# Altium project SCH-90818_A.PrjPcb (part 3 of 3)

## Sheet 09 MCU_LINK_USB.SchDoc
size 513 x 386 mm
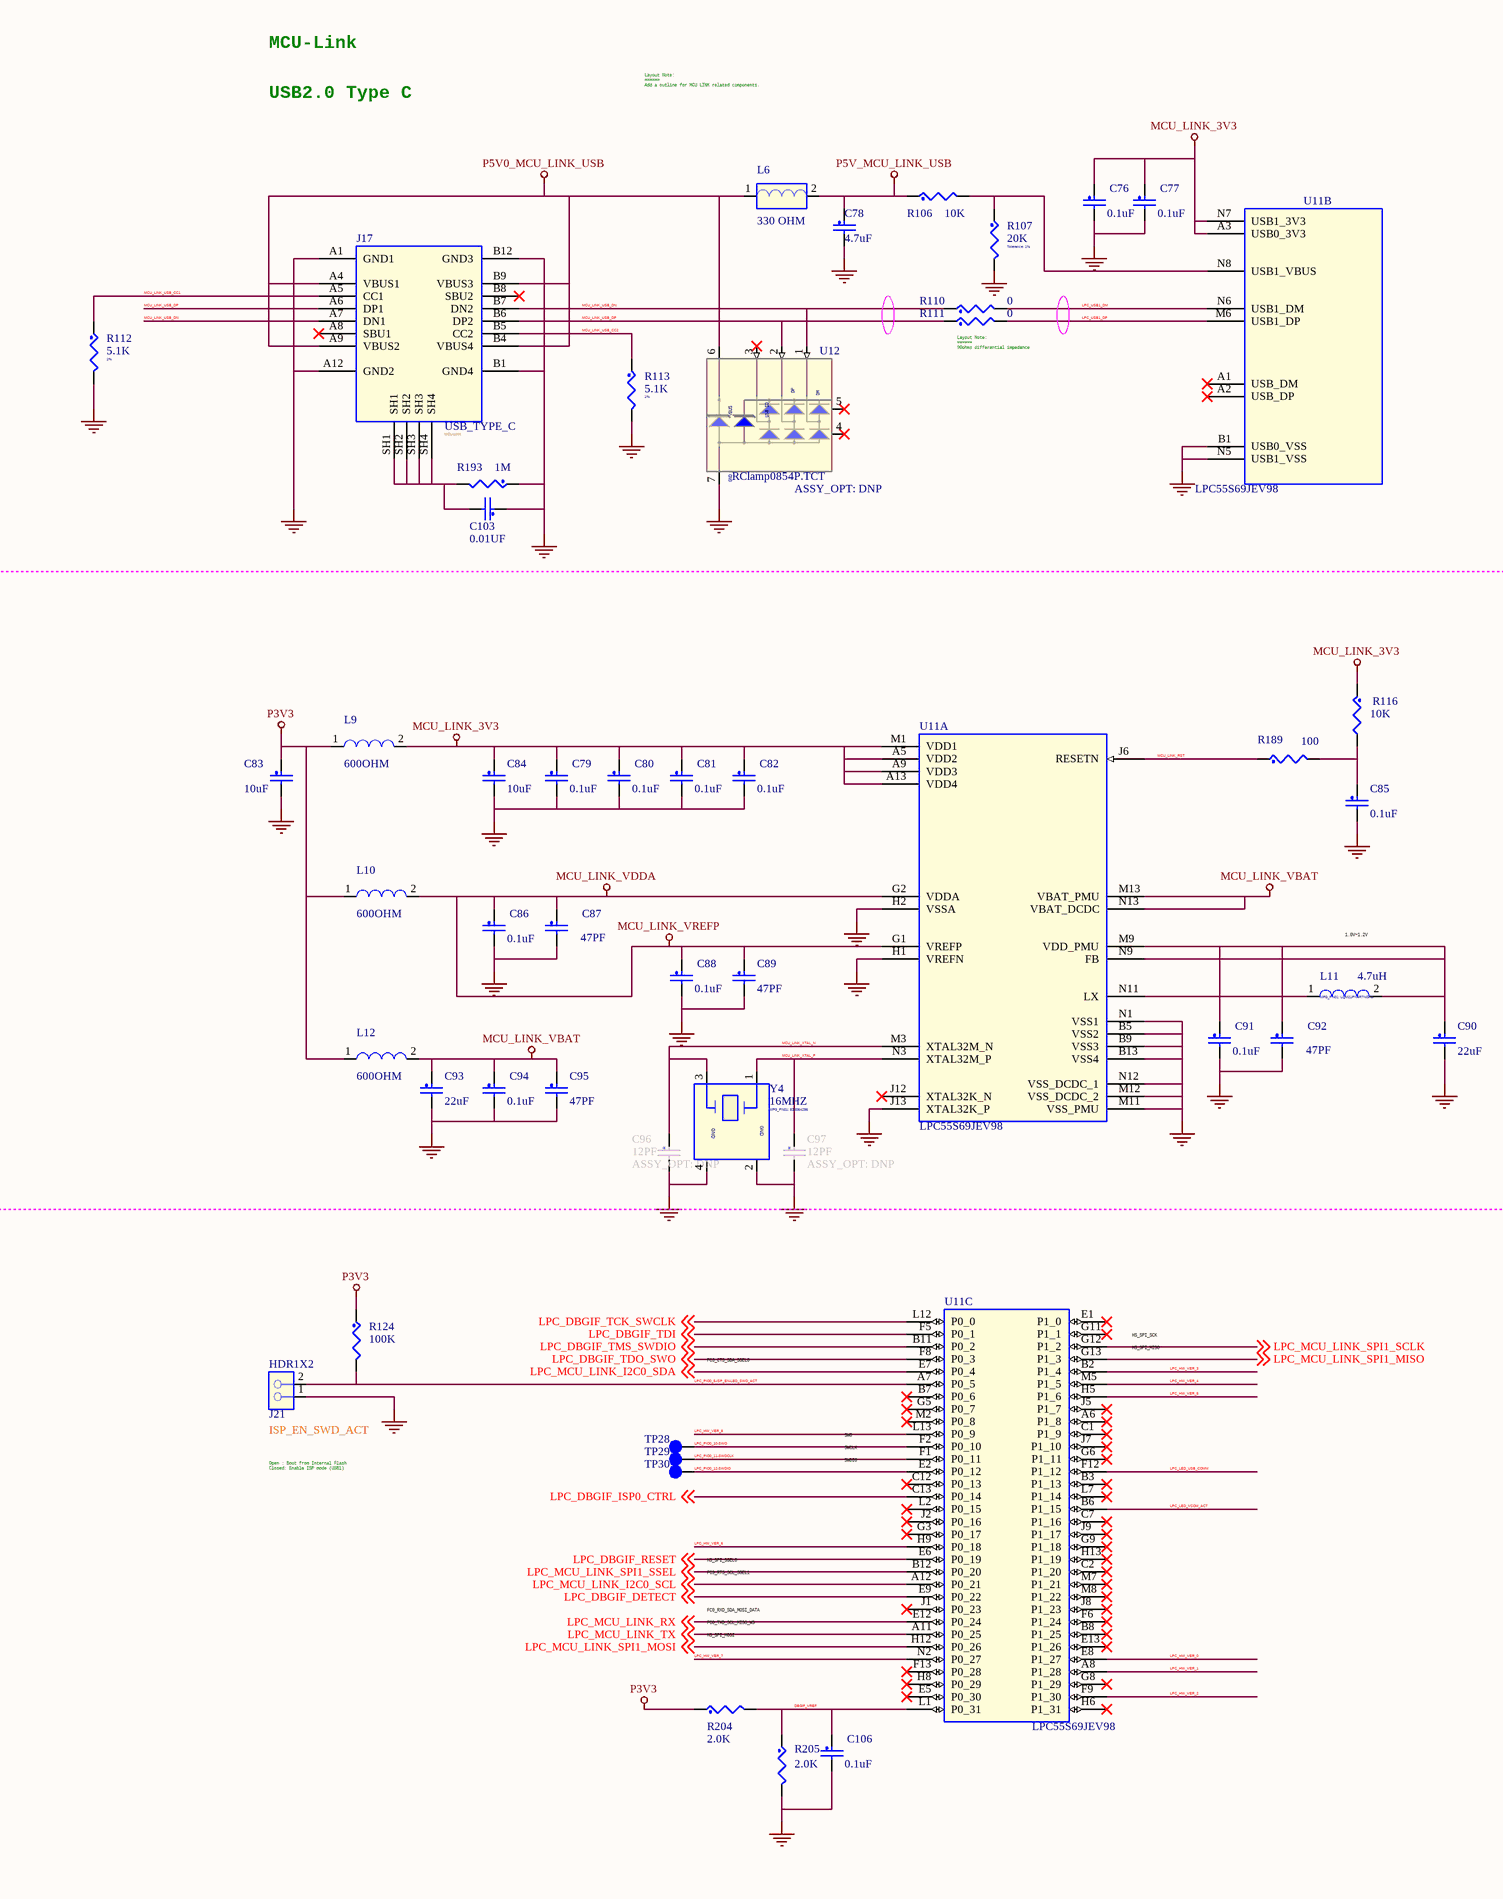
[diagram p10: 09 MCU_LINK_USB.SchDoc, left]
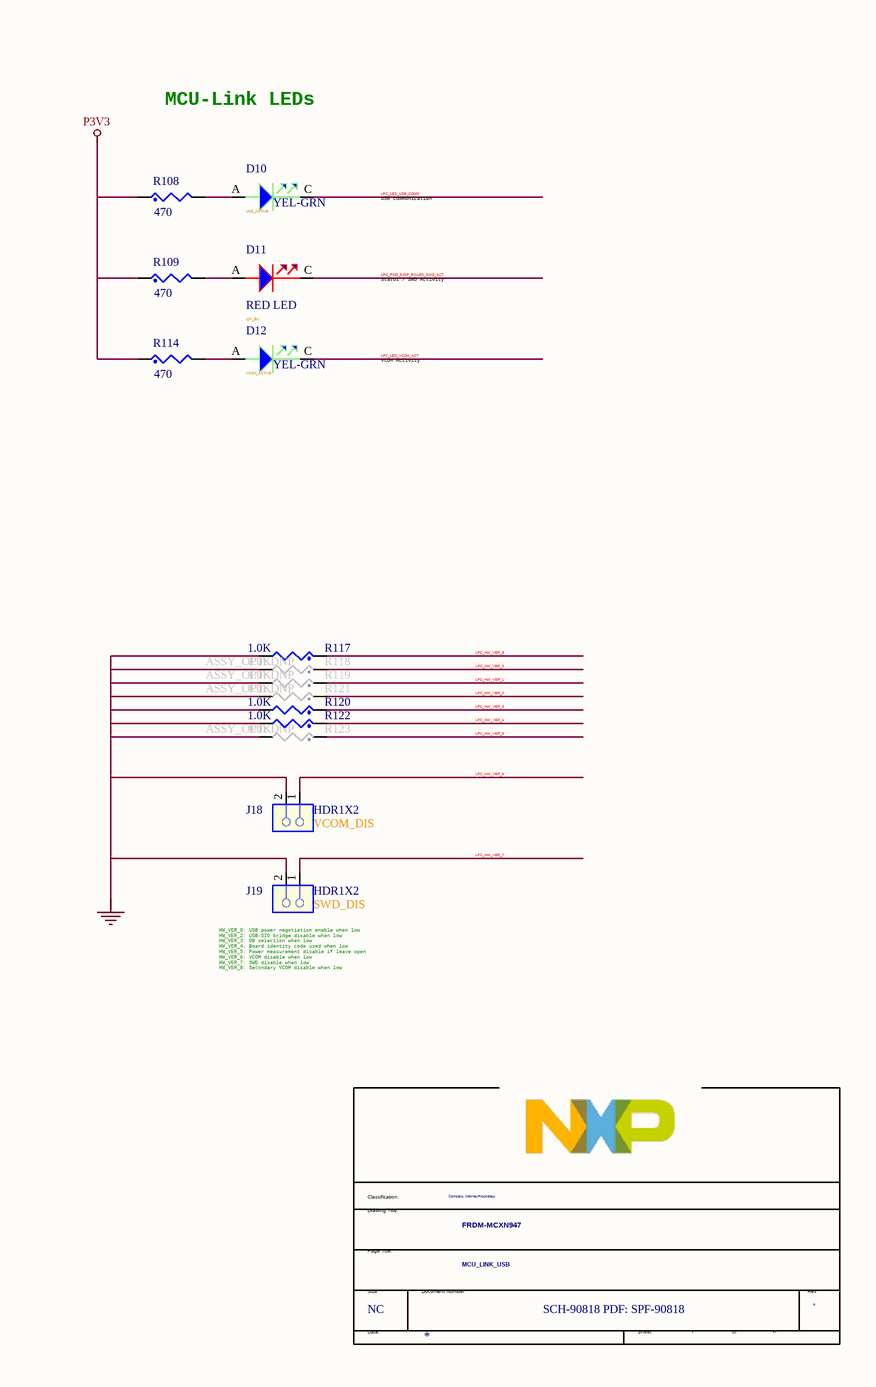
[diagram p11: 09 MCU_LINK_USB.SchDoc, right]

### Parts
(Parts that share a designator on the sheet are numbered #1, #2 ... from top to bottom, then left to right.)
*#6  Doc: SCH-90818 PDF: SPF-90818  RevCode: A  Title: FRDM-MCXN947  Page Size: NC  Page Number: 9  Page Count: 13  PageTitle: MCU_LINK_USB  Classification: Company Internal/Proprietary  (hidden comment: TitleBlock_FS)  (graphical)
C76  0.1uF  [CC0402_25]
C77  0.1uF  [CC0402_25]
C78  4.7uF  [CC0603_OV]
C79  0.1uF  [CC0402_25]
C80  0.1uF  [CC0402_25]
C81  0.1uF  [CC0402_25]
C82  0.1uF  [CC0402_25]
C83  10uF  [CC0603_OV]
C84  10uF  [CC0603_OV]
C85  0.1uF  [CC0402_25]
C86  0.1uF  [CC0402_25]
C87  47PF  [CC0402_25]
C88  0.1uF  [CC0402_25]
C89  47PF  [CC0402_25]
C90  22uF  [CC0603_OV]
C91  0.1uF  [CC0402_25]
C92  47PF  [CC0402_25]
C93  22uF  [CC0603_OV]
C94  0.1uF  [CC0402_25]
C95  47PF  [CC0402_25]
C96  12PF  ASSY_OPT: DNP  [CC0402_25]
C97  12PF  ASSY_OPT: DNP  [CC0402_25]
C103  0.01UF  [CC0805_OV]
C106  0.1uF  [CC0402_25]
D10  YEL-GRN  SILK: USB_ACTIVE  [led_1x0p6_sm]
D11  RED LED  SILK: ISP_EN  [led_1p1_1p1x0p6_sm]
D12  YEL-GRN  SILK: VCOM_ACTIVE  [led_1x0p6_sm]
J17  USB_TYPE_C  SILK: MCU-LINK  [con16_usb_type-c_ra_th]
J18  HDR1X2  SILK: VCOM_DIS  [hdr1x2_5p48x2p69]
J19  HDR1X2  SILK: SWD_DIS  [hdr1x2_5p48x2p69]
J21  HDR1X2  SILK: ISP_EN_SWD_ACT  [hdr1x2_5p48x2p69]
L6  330 OHM  [ind_1608]
L9  600OHM  [ind_1p8x1mm_sm]
L10  600OHM  [ind_1p8x1mm_sm]
L11  4.7uH  MFG_PN01: LQM21PN4R7NGRD  [IND_0805]
L12  600OHM  [ind_1p8x1mm_sm]
R106  10K  [RC0402_25]
R107  20K  Tolerance: 1%  [RC0402_25]
R108  470  [RC0402_25]
R109  470  [RC0402_25]
R110  0  [RC0402_25]
R111  0  [RC0402_25]
R112  5.1K  Tolerance: 1%  [RC0402_25]
R113  5.1K  Tolerance: 1%  [RC0402_25]
R114  470  [RC0402_25]
R116  10K  [RC0402_25]
R117  1.0K  [RC0402_25]
R118  1.0K  ASSY_OPT: DNP  [RC0402_25]
R119  1.0K  ASSY_OPT: DNP  [RC0402_25]
R120  1.0K  [RC0402_25]
R121  1.0K  ASSY_OPT: DNP  [RC0402_25]
R122  1.0K  [RC0402_25]
R123  1.0K  ASSY_OPT: DNP  [RC0402_25]
R124  100K  [RC0402_25]
R189  100  [RC0402_25]
R193  1M  [RC0805_OV]
R204  2.0K  [RC0402_25]
R205  2.0K  [RC0402_25]
TP28  TPAD_030  [TPAD_030]  (value not drawn)
TP29  TPAD_030  [TPAD_030]  (value not drawn)
TP30  TPAD_030  [TPAD_030]  (value not drawn)
U11  LPC55S69JEV98  [bga98_0p5_7x7]  (parts A,B,C of 3)
U12  RClamp0854P.TCT  ASSY_OPT: DNP  [slp1616p6]
Y4  16MHZ  MFG_PN01: 830064296  [xtal4_3p4x2p7_sm]

### Nets
GND: C76.2 C77.2 C78.2 C79.2 C80.2 C81.2 C82.2 C83.2 C84.2 C85.2 C86.2 C87.2 C88.2 C89.2 C90.2 C91.2 C92.2 C93.2 C94.2 C95.2 C96.2 C97.2 C103.1 C106.2 J17.A1(GND1) J17.A12(GND2) J17.B1(GND4) J17.B12(GND3) J18.2 J19.2 J21.1 R107.2 R112.2 R113.2 R117.2 R118.2 R119.2 R120.2 R121.2 R122.2 R123.2 R193.1 R205.2 U11.B1(USB0_VSS) U11.B5(VSS2) U11.B9(VSS3) U11.B13(VSS4) U11.H1(VREFN) U11.H2(VSSA) U11.J13(XTAL32K_P) U11.M11(VSS_PMU) U11.M12(VSS_DCDC_2) U11.N1(VSS1) U11.N5(USB1_VSS) U11.N12(VSS_DCDC_1) U12.7(GND) Y4.2 Y4.4
MCU_LINK_3V3: C76.1 C77.1 C79.1 C80.1 C81.1 C82.1 C84.1 L9.2 R116.1 U11.A3(USB0_3V3) U11.A5(VDD2) U11.A9(VDD3) U11.A13(VDD4) U11.M1(VDD1) U11.N7(USB1_3V3)
MCU_LINK_VBAT: C93.1 C94.1 C95.1 L12.2 U11.M13(VBAT_PMU) U11.N13(VBAT_DCDC)
MCU_LINK_VDDA: C86.1 C87.1 C88.1 C89.1 L10.2 U11.G1(VREFP) U11.G2(VDDA)  [also labelled MCU_LINK_VREFP]
P3V3: C83.1 L9.1 L10.1 L12.1 R108.1 R109.1 R114.1 R124.1 R204.1
P5V0_MCU_LINK_USB: J17.A4(VBUS1) J17.A9(VBUS2) J17.B4(VBUS4) J17.B9(VBUS3) L6.1 U12.6(VBUS)
P5V_MCU_LINK_USB: C78.1 L6.2 R106.1
DBGIF_VREF: C106.1 R204.2 R205.1 U11.L1(P0_31)
LPC_DBGIF_DETECT: U11.E9(P0_22) ; off-sheet LPC_DBGIF_DETECT
LPC_DBGIF_ISP0_CTRL: U11.C13(P0_14) ; off-sheet LPC_DBGIF_ISP0_CTRL
LPC_DBGIF_RESET: U11.E6(P0_19) ; off-sheet LPC_DBGIF_RESET
LPC_DBGIF_TCK_SWCLK: U11.L12(P0_0) ; off-sheet LPC_DBGIF_TCK_SWCLK
LPC_DBGIF_TDI: U11.F5(P0_1) ; off-sheet LPC_DBGIF_TDI
LPC_DBGIF_TDO_SWO: U11.F8(P0_3) ; off-sheet LPC_DBGIF_TDO_SWO
LPC_DBGIF_TMS_SWDIO: U11.B11(P0_2) ; off-sheet LPC_DBGIF_TMS_SWDIO
LPC_HW_VER_0: R118.1 U11.E8(P1_27)
LPC_HW_VER_1: R119.1 U11.A8(P1_28)
LPC_HW_VER_2: R121.1 U11.F9(P1_30)
LPC_HW_VER_3: R120.1 U11.B2(P1_4)
LPC_HW_VER_4: R122.1 U11.M5(P1_5)
LPC_HW_VER_5: R123.1 U11.H5(P1_6)
LPC_HW_VER_6: J18.1 U11.H9(P0_18)
LPC_HW_VER_7: J19.1 U11.N2(P0_27)
LPC_HW_VER_8: R117.1 U11.L13(P0_9)
LPC_LED_USB_COMM: D10.C(CATHODE) U11.F12(P1_12)
LPC_LED_VCOM_ACT: D12.C(CATHODE) U11.B6(P1_15)
LPC_MCU_LINK_I2C0_SCL: U11.A12(P0_21) ; off-sheet LPC_MCU_LINK_I2C0_SCL
LPC_MCU_LINK_I2C0_SDA: U11.E7(P0_4) ; off-sheet LPC_MCU_LINK_I2C0_SDA
LPC_MCU_LINK_RX: U11.E12(P0_24) ; off-sheet LPC_MCU_LINK_RX
LPC_MCU_LINK_SPI1_MISO: U11.G13(P1_3) ; off-sheet LPC_MCU_LINK_SPI1_MISO
LPC_MCU_LINK_SPI1_MOSI: U11.H12(P0_26) ; off-sheet LPC_MCU_LINK_SPI1_MOSI
LPC_MCU_LINK_SPI1_SCLK: U11.G12(P1_2) ; off-sheet LPC_MCU_LINK_SPI1_SCLK
LPC_MCU_LINK_SPI1_SSEL: U11.B12(P0_20) ; off-sheet LPC_MCU_LINK_SPI1_SSEL
LPC_MCU_LINK_TX: U11.A11(P0_25) ; off-sheet LPC_MCU_LINK_TX
LPC_PIO0_5-ISP_EN-LED_SWD_ACT: D11.C(CATHODE) J21.2 R124.2 U11.A7(P0_5)
LPC_PIO0_10-SWO: TP28.1(Pin1) U11.F2(P0_10)
LPC_PIO0_11-SWDCLK: TP29.1(Pin1) U11.F1(P0_11)
LPC_PIO0_12-SWDIO: TP30.1(Pin1) U11.E2(P0_12)
LPC_USB1_DM: R110.2 U11.N6(USB1_DM)
LPC_USB1_DP: R111.2 U11.M6(USB1_DP)
MCU_LINK_RST: R189.1 U11.J6(RESETN)
MCU_LINK_USB_CC1: J17.A5(CC1) R112.1
MCU_LINK_USB_CC2: J17.B5(CC2) R113.1
MCU_LINK_USB_DN: J17.A7(DN1) J17.B7(DN2) R110.1 U12.1(DM)
MCU_LINK_USB_DP: J17.A6(DP1) J17.B6(DP2) R111.1 U12.2(DP)
MCU_LINK_XTAL_N: C96.1 U11.M3(XTAL32M_N) Y4.3
MCU_LINK_XTAL_P: C97.1 U11.N3(XTAL32M_P) Y4.1
NetC85_1: C85.1 R116.2 R189.2
NetC90_1: C90.1 C91.1 C92.1 L11.2 U11.M9(VDD_PMU) U11.N9(FB)
NetC103_2: C103.2 J17.SH1 J17.SH2 J17.SH3 J17.SH4 R193.2
NetD10_A: D10.A(ANODE) R108.2
NetD11_A: D11.A(ANODE) R109.2
NetD12_A: D12.A(ANODE) R114.2
NetL11_1: L11.1 U11.N11(LX)
NetR106_2: R106.2 R107.1 U11.N8(USB1_VBUS)

Not connected (* = marked no-connect by the designer): J17 A8(SBU1)* B8(SBU2)*; U11 A1(USB_DM)* A2(USB_DP)* A6(P1_8)* B3(P1_13)* B7(P0_6)* B8(P1_25)* C1(P1_9)* C2(P1_20)* C7(P1_16)* C12(P0_13)* E1(P1_0)* E5(P0_30)* E13(P1_26)* F6(P1_24)* F13(P0_28)* G3(P0_17)* G5(P0_7)* G6(P1_11)* G8(P1_29)* G9(P1_18)* G11(P1_1)* H6(P1_31)* H8(P0_29)* H13(P1_19)* J1(P0_23)* J2(P0_16)* J5(P1_7)* J7(P1_10)* J8(P1_23)* J9(P1_17)* J12(XTAL32K_N)* L2(P0_15)* L7(P1_14)* M2(P0_8)* M7(P1_21)* M8(P1_22)*; U12 3(USB_ID)* 4(NC1)* 5(NC2)*

### Notes on the sheet
- MCU-Link
- Layout Note:
  ======
  Add a outline for MCU LINK related components.
- USB2.0 Type C
- (near R111) Layout Note:
  ======
  90ohms differential impedance
- MCU-Link LEDs
- USB Communication
- Status / SWD Activity
- 1.0V~1.2V
- VCOM Activity
- HS_SPI_SCK
- FC3_CTS_SDA_SSEL0
- HS_SPI_MISO
- Open : Boot from Internal Flash
  Closed: Enable ISP mode (USB1)
- SWO
- SWCLK
- SWDIO
- HW_VER_0: USB power negotiation enable when low
  HW_VER_2: USB-SIO bridge disable when low
  HW_VER_3: OB selection when low
  HW_VER_4: Board identity code used when low
  HW_VER_5: Power measurement disable if leave open
  HW_VER_6: VCOM disable when low
  HW_VER_7: SWD disable when low
  HW_VER_8: Secondary VCOM disable when low
- HS_SPI_SSEL0
- FC3_RTS_SCL_SSEL1
- HS_SPI_MOSI
- FC0_RXD_SDA_MOSI_DATA
- FC0_TXD_SCL_MISO_WS
- (in symbol TitleBlock_FS) Classification:; Drawing Title:; Page Title:; Size; Document Number; Rev; Date:; Sheet; of
- (in symbol XTAL_4P_B) GND

### Library data of the parts
*#6 = TitleBlock_FS: Classification: Public, Company Internal/Proprietary, Company Confidential,  Company Secret; Variant Name: <Core Design>; OrgAddr2: Austin, TX 78735-8598; OrgAddr1: 6501 William Cannon Drive West; OrgName: NXP Semiconductors; Page Create Date: March  8, 1995; Page Modify Date: *
C76 C79 C81 C86 C88 C91 = CAP_NP: CAP CER 0.1UF 16V 10% X7R 0402; CLASS: DISCRETE; Temp Range: -55C to +125C; SIGNAL_MODEL: DEFAULT_CAPACITOR_100000pF_2_1; AGILE_PN: 150-75182; MFG_NAME01: Samsung Electro-Mechanics; MFG_PN01: CL05B104KO5NNNC; CAD_APPROVED: Yes; FPLIST: CC0402_25,CC0402_HD,0402_CC,CAPC0402_L,cc0402_lamp3; Temp_Range: -55°C to +85°C; PCB Footprint: CC0402_25; 3D_Mechanical_Footprint_File: http://fcl.am.freescale.net/ALLEGRO/step/cc0402_25.STEP; Rated Voltage: 16V; Tolerance: 10%; ROHS: Yes; HEIGHT: 0.635MM; TOL: 10%; VOLTAGE: 16V
C77 C80 C82 C85 C94 C106 = CAP_NP: CAP CER 0.1UF 16V 10% X7R 0402; CLASS: DISCRETE; Temp_Range: -55°C to +85°C; FPLIST: CC0402_25,CC0402_HD,0402_CC,CAPC0402_L,cc0402_lamp3; CAD_APPROVED: Yes; MFG_PN01: CL05B104KO5NNNC; MFG_NAME01: Samsung Electro-Mechanics; AGILE_PN: 150-75182; SIGNAL_MODEL: DEFAULT_CAPACITOR_100000pF_2_1; Temp Range: -55C to +125C; PCB Footprint: CC0402_25; VOLTAGE: 16V; TOL: 10%; HEIGHT: 0.635MM; ROHS: Yes; Tolerance: 10%; Rated Voltage: 16V; 3D_Mechanical_Footprint_File: http://fcl.am.freescale.net/ALLEGRO/step/cc0402_25.STEP
C78 = CAP_NP: CAP CER 4.7uF 10V 20% X5R 0603; CLASS: DISCRETE; Temp Range: -55C TO 85C; FPLIST: CC0603_OV,CC0603,0603_CC; CAD_APPROVED: Yes; MFG_PN01: 885012106012; MFG_NAME01: WURTH ELEKTRONIK; AGILE_PN: 150-81893; PCB Footprint: CC0603_OV; 3D_Mechanical_Footprint_File: http://fcl.am.freescale.net/ALLEGRO/step/cc0603_ov.STEP; Rated Voltage: 10V; Package Type: WCAP-CSGP_0603; Package Size: 0603; HEIGHT: 0.87MM; ROHS: Yes; Tolerance: 20%; VOLTAGE: 10V; TOL: 20%
C83 = CAP_NP: CAP CER 10uF 25V 10% X5R 0603; CLASS: DISCRETE; AGILE_PN: 150-79569; CAD_APPROVED: Yes; MFG_NAME01: SANYEAR; MFG_PN01: C0603X5R106K250NT; PCB Footprint: CC0603_OV; Package Size: 0603 [1608 Metric]; HEIGHT: 1MM; Package Type: SMD/SMT; Tolerance: 10%; Rated Voltage: 25V; ROHS: Yes; 3D_Mechanical_Footprint_File: http://fcl.am.freescale.net/ALLEGRO/step/cc0603_ov.STEP
C84 = CAP_NP: CAP CER 10uF 25V 10% X5R 0603; CLASS: DISCRETE; MFG_PN01: C0603X5R106K250NT; MFG_NAME01: SANYEAR; CAD_APPROVED: Yes; AGILE_PN: 150-79569; PCB Footprint: CC0603_OV; 3D_Mechanical_Footprint_File: http://fcl.am.freescale.net/ALLEGRO/step/cc0603_ov.STEP; ROHS: Yes; Rated Voltage: 25V; Tolerance: 10%; Package Type: SMD/SMT; HEIGHT: 1MM; Package Size: 0603 [1608 Metric]
C87 C92 = CAP_NP: CAP CER 47PF 50V 5% C0G 0402; CLASS: DISCRETE; MFG_PN01: GMC04CG470J50NT-LF; MFG_NAME01: CAL-CHIP; Temp Range: -55C to +125C; CAD_APPROVED: Yes; FPLIST: CC0402_25,CC0402_HD,0402_CC,capc0402_l; AGILE_PN: 150-75169; PCB Footprint: CC0402_25; ROHS: Yes; Rated Voltage: 50V; Tolerance: 5%; HEIGHT: 0.64 MM
C89 C95 = CAP_NP: CAP CER 47PF 50V 5% C0G 0402; CLASS: DISCRETE; AGILE_PN: 150-75169; FPLIST: CC0402_25,CC0402_HD,0402_CC,capc0402_l; CAD_APPROVED: Yes; Temp Range: -55C to +125C; MFG_NAME01: CAL-CHIP; MFG_PN01: GMC04CG470J50NT-LF; PCB Footprint: CC0402_25; HEIGHT: 0.64 MM; Tolerance: 5%; Rated Voltage: 50V; ROHS: Yes
C90 C93 = CAP_NP: CAP CER 22uF 10V 20% X5R 0603; CLASS: DISCRETE; MFG_PN01: CL10A226MP7LUNC; MFG_NAME01: SAMSUNG; Temp Range: -55C to +85C; CAD_APPROVED: Yes; FPLIST: CC0603_OV,CC0603,0603_cc_tol; AGILE_PN: 150-79530; ROHS: Yes; Rated Voltage: 10V; Tolerance: 20%; HEIGHT: 1MM; Package Size: 0603; PCB Footprint: CC0603_OV
C96 C97 = CAP_NP: CAP CER 12PF 25V 5% C0G 0402; CLASS: DISCRETE; AGILE_PN: 150-30180; FPLIST: CC0402_25,CC0402_HD,0402_CC,capc0402_l; CAD_APPROVED: Yes; Temp Range: -55C to +125C; MFG_NAME01: KEMET; MFG_PN01: C0402C120J3GAC7867; PCB Footprint: CC0402_25; HEIGHT: 0.55 MM; Tolerance: 5%; Rated Voltage: 25V; ROHS: Yes
C103 = CAP_NP: CAP CER 0.01UF 50V 10% X7R 0805; CLASS: DISCRETE; AGILE_PN: 150-75010; FPLIST: CC0805_OV,CC0805,0805_CC; CAD_APPROVED: Yes; Temp Range: -55C to +125C; MFG_NAME01: VENKEL COMPANY; MFG_PN01: C0805X7R500-103KNE; PCB Footprint: CC0805_OV; Package Size: 0805; HEIGHT: 1.4732 MM; Tolerance: 10%; Rated Voltage: 50V; ROHS: Yes
D10 D12 = LED: LED YEL-GRN SGL 25mA SMT 0402; CLASS: IC; AGILE_PN: 370-76900; Rated Voltage: 1.7-2.2V@5mA; CAD_APPROVED: YES; Temp Range: -35¡ãC to +85¡ãC; MFG_NAME01: Lianyungang Meihua Electronics Technology Co.,Ltd; MFG_PN01: MHT136CGCT; Package Size: 1 x 0.5 x 0.3 mm; HEIGHT: 0.35MM; VOLTAGE: 1.7-2.2V@5mA; PCB Footprint: led_1x0p6_sm
D11 = LED: LED RED SGL 30mA 5V 0402; CLASS: IC; MFG_PN01: 150040SS73240; MFG_NAME01: Wurth Electronik GmbH & Co. KG (PCB); Temp Range: -40¡ã C to + 85¡ã C; CAD_APPROVED: YES; AGILE_PN: 370-77428; 3D_Mechanical_Footprint_File: http://fcl.am.freescale.net/ALLEGRO/step/led_1p1_1p1x0p6_sm.STEP; HEIGHT: 0.5 MM; PCB Footprint: led_1p1_1p1x0p6_sm
J17 = USB16_TYPEC_4SH: CON 2X8 USB2.0_TYPE_C RCPT 0.85MM 144H AU 63L; CLASS: IO; AGILE_PN: 210-82931; CAD_APPROVED: Yes; Temp Range: -40 ¡ãC to +85 ¡ãC; MFG_NAME01: GCT; MFG_PN01: USB4085-GF-A; PCB Footprint: con16_usb_type-c_ra_th; HEIGHT: 3.66 MM; Package Type: Through Hole, Right Angle; ROHS: Yes
J18 = CONN_HDR_2X1: HDR 1X2 TH 100MIL SP 342H AU 118L; CLASS: IO; JUMPER(DEFAULT): OPEN; AGILE_PN: 210-80468; CAD_APPROVED: Yes; Temp Range: -40¡ãC to 105¡ãC; MFG_NAME01: WURTH ELEKTRONIK EISOS GMBH & CO. KG (ELECTRONIC & ELECTROMEHANICAL COMP); MFG_PN01: 61300211121; HEIGHT: 8.69MM; Package Type: TH; ROHS: Yes; 3D_Mechanical_Footprint_File: http://fcl.am.freescale.net/ALLEGRO/step/hdr1x2_5p48x2p69.STEP; PCB Footprint: hdr1x2_5p48x2p69
J19 = CONN_HDR_2X1: HDR 1X2 TH 100MIL SP 342H AU 118L; CLASS: IO; JUMPER(DEFAULT): OPEN; MFG_PN01: 61300211121; MFG_NAME01: WURTH ELEKTRONIK EISOS GMBH & CO. KG (ELECTRONIC & ELECTROMEHANICAL COMP); Temp Range: -40¡ãC to 105¡ãC; CAD_APPROVED: Yes; AGILE_PN: 210-80468; 3D_Mechanical_Footprint_File: http://fcl.am.freescale.net/ALLEGRO/step/hdr1x2_5p48x2p69.STEP; ROHS: Yes; Package Type: TH; HEIGHT: 8.69MM; PCB Footprint: hdr1x2_5p48x2p69
J21 = CONN_HDR_2X1: HDR 1X2 TH 100MIL SP 342H AU 118L; CLASS: IO; MFG_PN01: 61300211121; MFG_NAME01: WURTH ELEKTRONIK EISOS GMBH & CO. KG (ELECTRONIC & ELECTROMEHANICAL COMP); Temp Range: -40¡ãC to 105¡ãC; CAD_APPROVED: Yes; AGILE_PN: 210-80468; 3D_Mechanical_Footprint_File: http://fcl.am.freescale.net/ALLEGRO/step/hdr1x2_5p48x2p69.STEP; ROHS: Yes; Package Type: TH; HEIGHT: 8.69MM; PCB Footprint: hdr1x2_5p48x2p69
L6 = BEAD: IND FER BEAD 330OHM@100MHZ 1.7A 0603; PART_TYPE: FERRITE\BEAD; CLASS: DISCRETE; TOL: 25%; CAD_APPROVED: Yes; MFG_PN01: MPZ1608S331A; MFG_NAME01: TDK; AGILE_PN: 180-78156; PCB Footprint: ind_1608; HEIGHT: 0.95MM; ROHS: Yes; Tolerance: 25%
L9 L12 = INDUCTOR: IND FER BEAD 600OHM@100MHz 1A 25% 0603; CLASS: DISCRETE; AGILE_PN: 180-78469; CAD_APPROVED: Yes; MFG_NAME01: WURTH ELEKTRONIK EISOS GMBH & CO. KG (ELECTRONIC & ELECTROMEHANICAL COMP); MFG_PN01: 742792651; HEIGHT: 1MM; ROHS: Yes; 3D_Mechanical_Footprint_File: http://fcl.am.freescale.net/ALLEGRO/step/ind_1p8x1mm_sm.step; PCB Footprint: ind_1p8x1mm_sm
L10 = INDUCTOR: IND FER BEAD 600OHM@100MHz 1A 25% 0603; CLASS: DISCRETE; MFG_PN01: 742792651; MFG_NAME01: WURTH ELEKTRONIK EISOS GMBH & CO. KG (ELECTRONIC & ELECTROMEHANICAL COMP); CAD_APPROVED: Yes; AGILE_PN: 180-78469; 3D_Mechanical_Footprint_File: http://fcl.am.freescale.net/ALLEGRO/step/ind_1p8x1mm_sm.step; ROHS: Yes; HEIGHT: 1MM; PCB Footprint: ind_1p8x1mm_sm
L11 = INDUCTOR: IND -- 4.7uH@1MHZ 800mA 0.23 OHM 30% 0805; CLASS: DISCRETE; MFG_NAME01: MURATA; Temp Range: -55¡ãC to 125¡ãC; CAD_APPROVED: Yes; FPLIST: IND_0805,0805_CC; AGILE_PN: 180-81632; PCB Footprint: IND_0805; 3D_Mechanical_Footprint_File: http://fcl.am.freescale.net/ALLEGRO/step/ind_0805.STEP; ROHS: Yes; HEIGHT: 1MM; Package Size: 0805 (2012 metric)
R106 R116 = RES: RES MF 10K 1/16W 1% 0402; CLASS: DISCRETE; Temp_Range: –55 °C to +155 °C; TOL: 5%; FPLIST: RC0402_25,RC0402_HD,0402_CC,RC0402_X2; CAD_APPROVED: Yes; MFG_PN01: NRCL04F1002TRF; MFG_NAME01: NIC COMPONENTS CORP; AGILE_PN: 470-80452; SIGNAL_MODEL: DEFAULT_RESISTOR_10000OHM_2_1; HEIGHT: 0.40 MM; ROHS: Yes; Tolerance: 1%; PCB Footprint: RC0402_25
R107 = RES: RES MF 20K 1/16W 1% 0402; CLASS: DISCRETE; AGILE_PN: 470-76103; FPLIST: RC0402_25,RC0402_HD,0402_CC; CAD_APPROVED: Yes; MFG_NAME01: WALSIN TECHNOLOGY CORP.; MFG_PN01: WR04X2002FTL; PCB Footprint: RC0402_25; HEIGHT: 0.4MM; ROHS: Yes
R108 R114 = RES: RES MF 470 OHM 1/16W 5% 0402; CLASS: DISCRETE; Temp_Range: -55&#8451; to 155&#8451;; SIGNAL_MODEL: DEFAULT_RESISTOR_430.000000OHM_2_1; FPLIST: RC0402_25,RC0402_HD,0402_CC; CAD_APPROVED: Yes; MFG_PN01: ERJ2GEJ471X; MFG_NAME01: PANASONIC; AGILE_PN: 470-30315; TOL: 1%; ROHS: Yes; Tolerance: 5%; HEIGHT: 0.45mm; PCB Footprint: RC0402_25
R109 = RES: RES MF 470 OHM 1/16W 5% 0402; CLASS: DISCRETE; TOL: 1%; AGILE_PN: 470-30315; MFG_NAME01: PANASONIC; MFG_PN01: ERJ2GEJ471X; CAD_APPROVED: Yes; FPLIST: RC0402_25,RC0402_HD,0402_CC; SIGNAL_MODEL: DEFAULT_RESISTOR_430.000000OHM_2_1; Temp_Range: -55&#8451; to 155&#8451;; HEIGHT: 0.45mm; Tolerance: 5%; ROHS: Yes; PCB Footprint: RC0402_25
R110 R111 = RES: RES MF ZERO OHM 1/16W 5% 0402; CLASS: DISCRETE; MFG_PN01: CR0402-J/-000GLF; MFG_NAME01: BOURNS; CAD_APPROVED: Yes; FPLIST: RC0402_25,RC0402_HD,RC0402_X2,0402_CC,rc0402_lamp3; AGILE_PN: 470-75394; ROHS: Yes; Tolerance: 5%; HEIGHT: 0.45 MM; PCB Footprint: RC0402_25
R112 R113 = RES: RES MF 5.1K 1/16W 1% 0402; CLASS: DISCRETE; AGILE_PN: 470-76474; FPLIST: RC0402_25,RC0402_HD,0402_CC; CAD_APPROVED: Yes; MFG_NAME01: THYE MING TECH CO LTD; MFG_PN01: CR02FL6--5K1; HEIGHT: 0.4MM; ROHS: Yes; PCB Footprint: RC0402_25
R117 R122 R123 = RES: RES MF 1.0K 1/16W 1% 0402; CLASS: DISCRETE; MFG_PN01: CR0402-FX-1001GLF; MFG_NAME01: BOURNS; CAD_APPROVED: Yes; FPLIST: RC0402_25,RC0402_HD,RC0402_X2,0402_CC; AGILE_PN: 470-76037; ROHS: Yes; Tolerance: 1%; HEIGHT: 0.4MM; PCB Footprint: RC0402_25
R118-R121 = RES: RES MF 1.0K 1/16W 1% 0402; CLASS: DISCRETE; AGILE_PN: 470-76037; FPLIST: RC0402_25,RC0402_HD,RC0402_X2,0402_CC; CAD_APPROVED: Yes; MFG_NAME01: BOURNS; MFG_PN01: CR0402-FX-1001GLF; HEIGHT: 0.4MM; Tolerance: 1%; ROHS: Yes; PCB Footprint: RC0402_25
R124 = RES: RES MF 100K 1/16W 1% 0402; CLASS: DISCRETE; MFG_PN01: CR0402-FX-1003GLF; MFG_NAME01: BOURNS; CAD_APPROVED: Yes; FPLIST: RC0402_25,RC0402_HD,0402_CC; AGILE_PN: 470-76240; ROHS: Yes; Tolerance: 1%; HEIGHT: 0.4MM; PCB Footprint: RC0402_25
R189 = RES: RES MF 100 OHM 1/16W 5% 0402; CLASS: DISCRETE; AGILE_PN: 470-75591; FPLIST: RC0402_25,RC0402_HD,RC0402_X2,0402_CC; CAD_APPROVED: Yes; MFG_NAME01: BOURNS; MFG_PN01: CR0402-JW-101GLF; PCB Footprint: RC0402_25; HEIGHT: 0.45mm; Tolerance: 5%; ROHS: Yes
R193 = RES: RES MF 1M 1/10W 5%  0805; CLASS: DISCRETE; MFG_PN01: RC73L2A105JTF; MFG_NAME01: SMEC; Temp Range: -55¡ãC to +175¡ãC; CAD_APPROVED: Yes; FPLIST: RC0805_OV,RC0805,0805_CC; AGILE_PN: 470-76691; ROHS: Yes; Tolerance: 5%; HEIGHT: 0.55MM; PCB Footprint: RC0805_OV
R204 = RES: RES MF 2.0K 1/16W 1% 0402; CLASS: DISCRETE; MFG_PN01: CR0402-FX-2001GLF; MFG_NAME01: BOURNS; CAD_APPROVED: Yes; FPLIST: RC0402_25,RC0402_HD,0402_CC,rc0402_ghwe; AGILE_PN: 470-75356; PCB Footprint: RC0402_25; 3D_Mechanical_Footprint_File: http://fcl.am.freescale.net/ALLEGRO/step/rc0402_25.STEP; ROHS: Yes; Tolerance: 1%; HEIGHT: 0.4mm
R205 = RES: RES MF 2.0K 1/16W 1% 0402; CLASS: DISCRETE; AGILE_PN: 470-75356; FPLIST: RC0402_25,RC0402_HD,0402_CC,rc0402_ghwe; CAD_APPROVED: Yes; MFG_NAME01: BOURNS; MFG_PN01: CR0402-FX-2001GLF; PCB Footprint: RC0402_25; HEIGHT: 0.4mm; Tolerance: 1%; ROHS: Yes; 3D_Mechanical_Footprint_File: http://fcl.am.freescale.net/ALLEGRO/step/rc0402_25.STEP
TP28 TP30 = TESTLOOP: TEST POINT PAD 30MIL DIA SMT, NO PART TO ORDER; CLASS: IO; CAD_APPROVED: Yes; MFG_PN01: NOTACOMPONENT; AGILE_PN: 211-76642; HEIGHT: 0.1MM; ROHS: Yes; MFG_NAME01: NOTACOMPONENT; 3D_Mechanical_Footprint_File: http://fcl.am.freescale.net/ALLEGRO/step/tpad_030.STEP; PCB Footprint: TPAD_030
TP29 = TESTLOOP: as TP20-TP22 on sheet 08 CAN PHY & ETHERNET P; 3D_Mechanical_Footprint_File: http://fcl.am.freescale.net/ALLEGRO/step/tpad_030.STEP; MFG_PN01: NOTACOMPONENT; ROHS: Yes; HEIGHT: 0.1MM; PCB Footprint: TPAD_030
U11 = NIOBE4_MINI_FBGA98: IC MCU ARM FLASH 640KB SRAM 320KB 1.8-3.6V VFBGA 98; AGILE_PN: 344-02410; FPLIST: bga98_0p5_7x7,bga98_0p5_7x7_c010s_nsp; CAD_APPROVED: Yes; VOLTAGE: 1.8/3.6V; Temp Range: -40 to +105C; MFG_NAME01: NXP SEMICONDUCTOR; CLASS: IC; PCB Footprint: bga98_0p5_7x7; HEIGHT: 0.97 MM; Supply Voltage: 1.8-3.6V; ROHS: Yes; MFG_PN01: LPC55S69JEV98; 3D_Mechanical_Footprint_File: http://fcl.am.freescale.net/ALLEGRO/step/bga98_0p5_7x7.step
U12 = RCLAMP1654P_NEW: DIODE TVS ARRAY 3 5.5V SLP1616P6; CLASS: IC; CAD_APPROVED: Yes; MFG_NAME01: SEMTECH CORP; AGILE_PN: 480-78843; HEIGHT: 0.65MM; ROHS: Yes; MFG_PN01: RClamp0854P.TCT; Rated Voltage: 5.5V; VOLTAGE: 5.5V; 3D_Mechanical_Footprint_File: http://fcl.am.freescale.net/ALLEGRO/step/slp1616p6.step; PCB Footprint: slp1616p6
Y4 = XTAL_4P_B: XTAL 16MHz 20ppm 8pF SMT; CLASS: IC; MFG_NAME01: W¨¹rth Elektronik; Temp Range: -10.00 to 70.00¡ãC; CAD_APPROVED: Yes; Frequency Tolerance: ¡À20ppm; AGILE_PN: 230-78680; 3D_Mechanical_Footprint_File: http://fcl.am.freescale.net/ALLEGRO/step/xtal4_3p4x2p7_sm.STEP; ROHS: Yes; HEIGHT: 0.8MM; PCB Footprint: xtal4_3p4x2p7_sm

## Sheet 10 MCU_LINK_DEBUG.SchDoc
size 513 x 386 mm
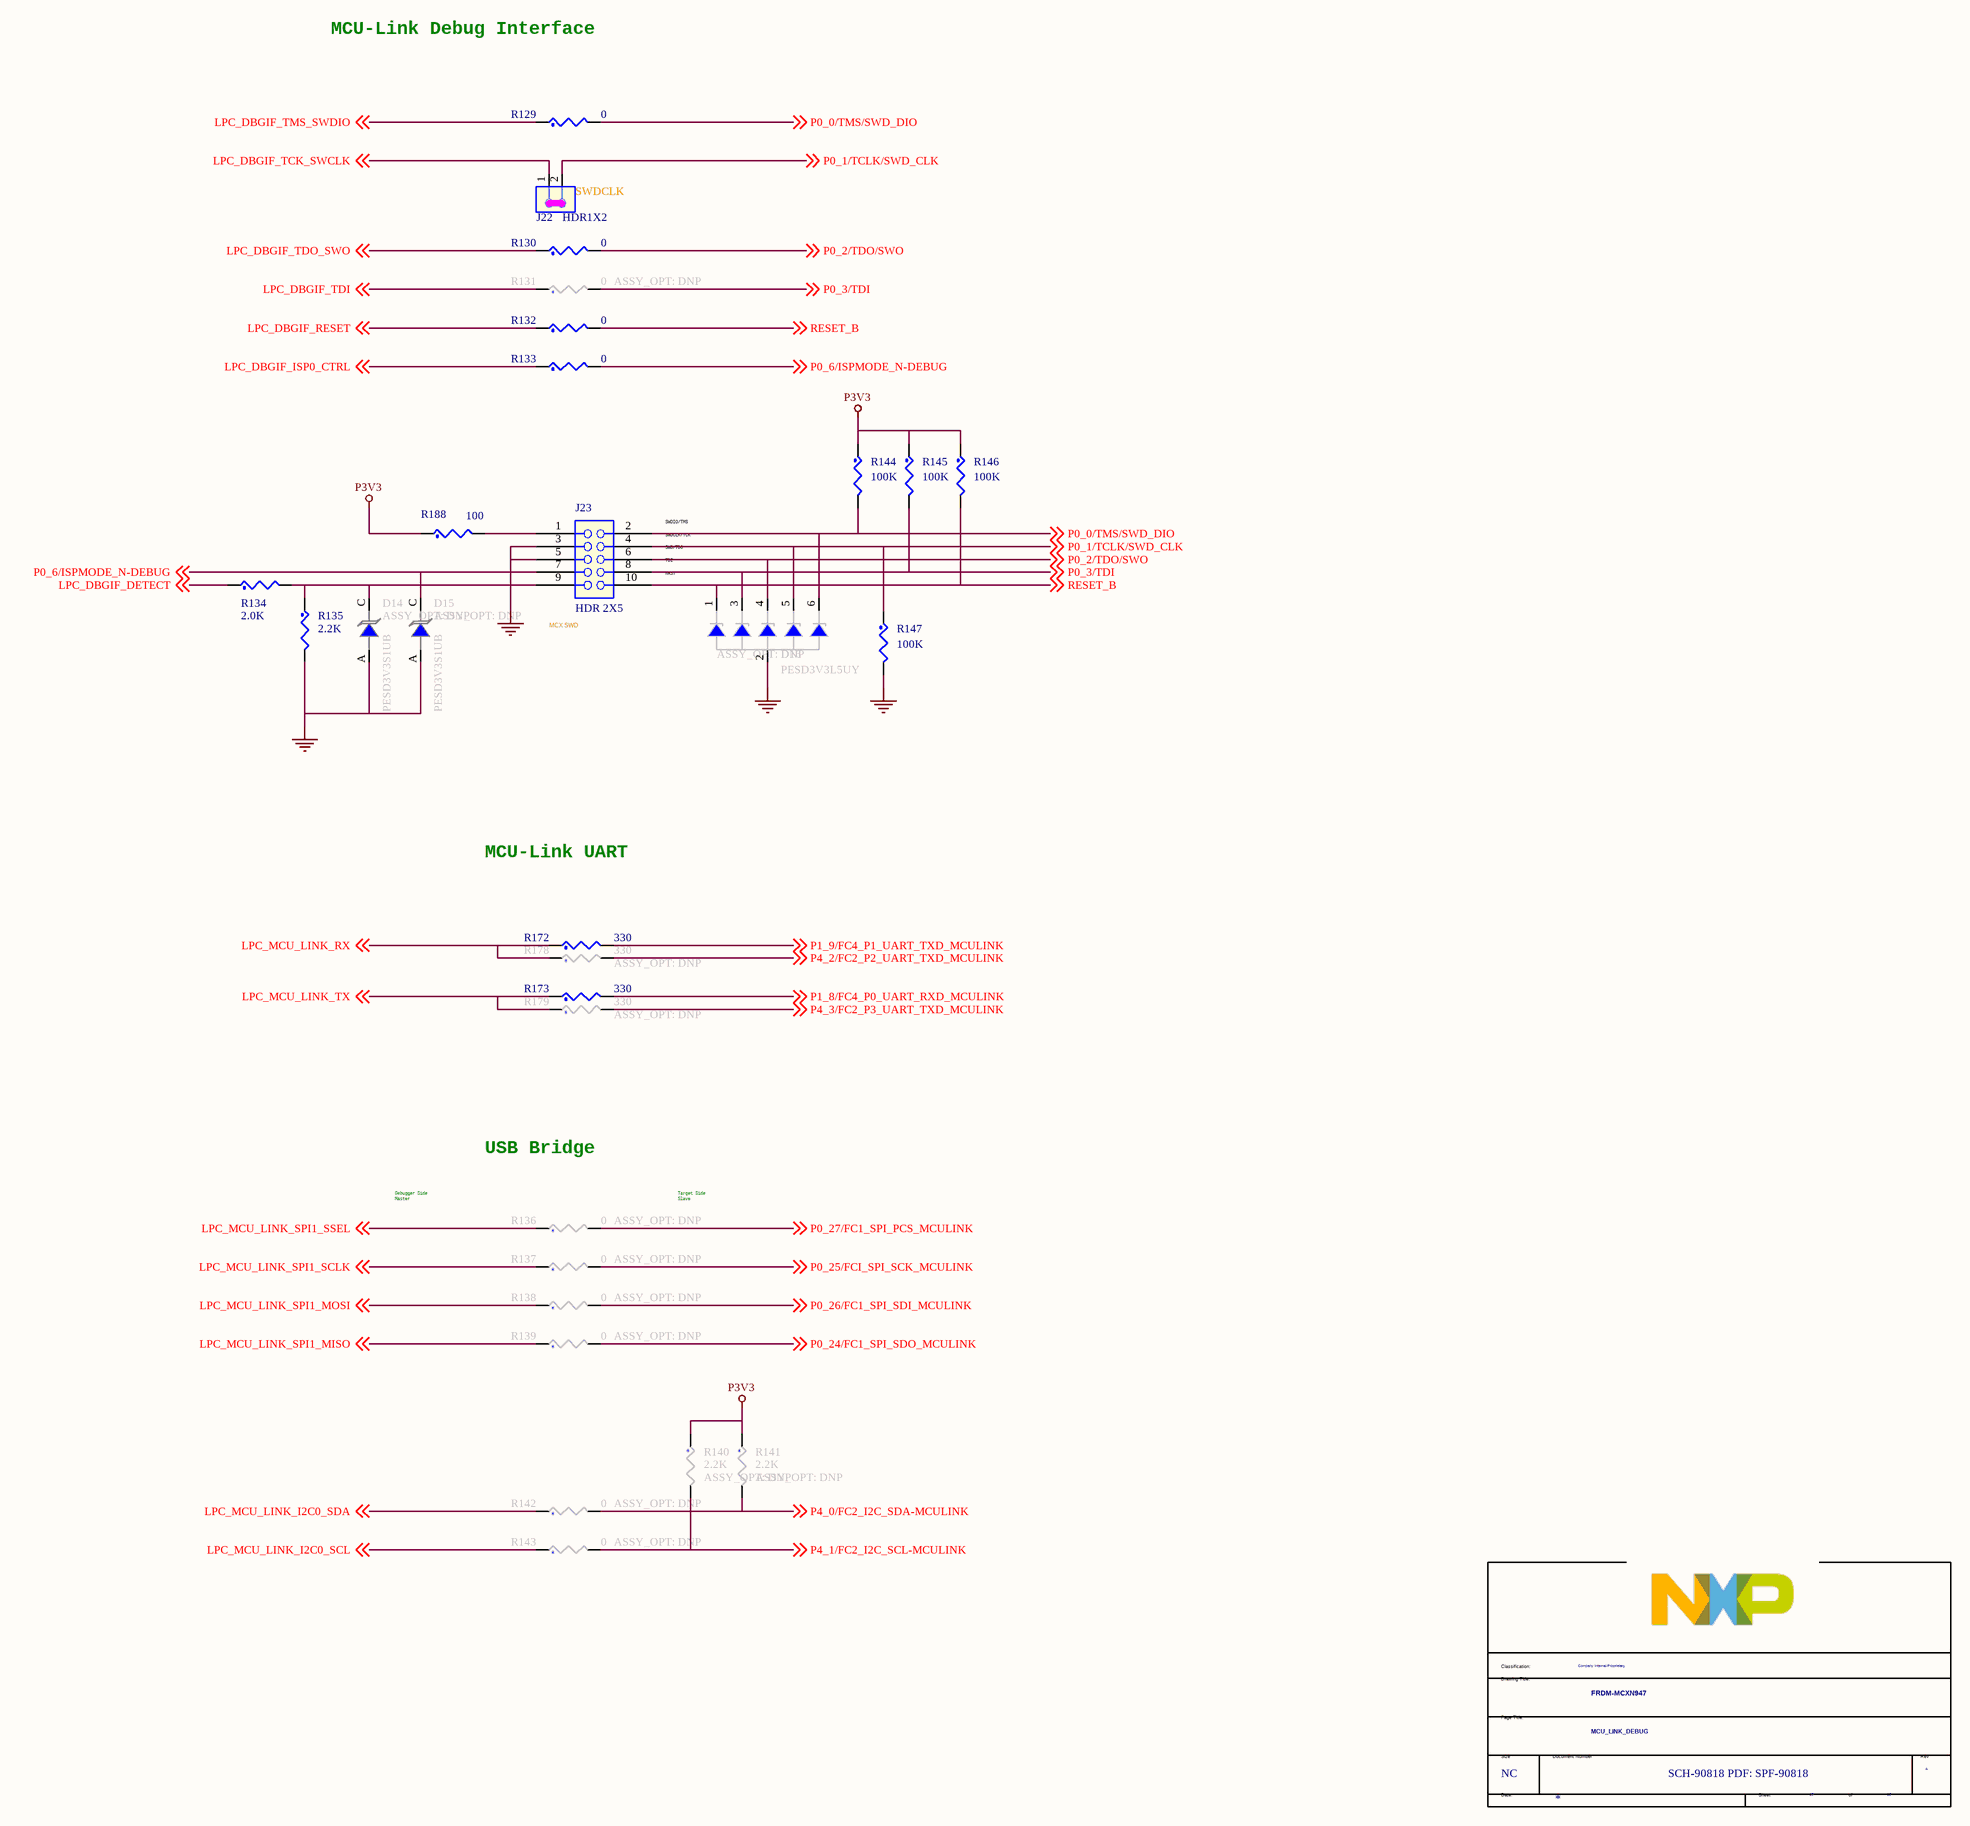
[diagram p12: 10 MCU_LINK_DEBUG.SchDoc]

### Parts
(Parts that share a designator on the sheet are numbered #1, #2 ... from top to bottom, then left to right.)
*#7  Doc: SCH-90818 PDF: SPF-90818  RevCode: A  Title: FRDM-MCXN947  Page Size: NC  Page Number: 10  Page Count: 13  PageTitle: MCU_LINK_DEBUG  Classification: Company Internal/Proprietary  (hidden comment: TitleBlock_FS)  (graphical)
D14  PESD3V3S1UB  ASSY_OPT: DNP  [sod523]
D15  PESD3V3S1UB  ASSY_OPT: DNP  [sod523]
D16  PESD3V3L5UY  ASSY_OPT: DNP  [sot-363_0p65_smt]
J22  HDR1X2  SILK: SWDCLK  [hdr1x2_5p48x2p69]
J23  HDR 2X5  SILK: MCX SWD  [hdr_5X2_ftsh_th]
R129  0  [RC0402_25]
R130  0  [RC0402_25]
R131  0  ASSY_OPT: DNP  [RC0402_25]
R132  0  [RC0402_25]
R133  0  [RC0402_25]
R134  2.0K  [RC0402_25]
R135  2.2K  [RC0402_25]
R136  0  ASSY_OPT: DNP  [RC0402_25]
R137  0  ASSY_OPT: DNP  [RC0402_25]
R138  0  ASSY_OPT: DNP  [RC0402_25]
R139  0  ASSY_OPT: DNP  [RC0402_25]
R140  2.2K  ASSY_OPT: DNP  [RC0402_25]
R141  2.2K  ASSY_OPT: DNP  [RC0402_25]
R142  0  ASSY_OPT: DNP  [RC0402_25]
R143  0  ASSY_OPT: DNP  [RC0402_25]
R144  100K  [RC0402_25]
R145  100K  [RC0402_25]
R146  100K  [RC0402_25]
R147  100K  [RC0402_25]
R172  330  [RC0603_OV]
R173  330  [RC0603_OV]
R178  330  ASSY_OPT: DNP  [RC0603_OV]
R179  330  ASSY_OPT: DNP  [RC0603_OV]
R188  100  [RC0402_25]

### Nets
GND: D14.A D15.A D16.2(A) J23.3(A2) J23.5(A3) R135.2 R147.2
P3V3: R140.1 R141.1 R144.1 R145.1 R146.1 R188.1
LPC_DBGIF_DETECT: R134.1 ; off-sheet LPC_DBGIF_DETECT
LPC_DBGIF_ISP0_CTRL: R133.1 ; off-sheet LPC_DBGIF_ISP0_CTRL
LPC_DBGIF_RESET: R132.1 ; off-sheet LPC_DBGIF_RESET
LPC_DBGIF_TCK_SWCLK: J22.1 ; off-sheet LPC_DBGIF_TCK_SWCLK
LPC_DBGIF_TDI: R131.1 ; off-sheet LPC_DBGIF_TDI
LPC_DBGIF_TDO_SWO: R130.1 ; off-sheet LPC_DBGIF_TDO_SWO
LPC_DBGIF_TMS_SWDIO: R129.1 ; off-sheet LPC_DBGIF_TMS_SWDIO
LPC_MCU_LINK_I2C0_SCL: R143.1 ; off-sheet LPC_MCU_LINK_I2C0_SCL
LPC_MCU_LINK_I2C0_SDA: R142.1 ; off-sheet LPC_MCU_LINK_I2C0_SDA
LPC_MCU_LINK_RX: R172.1 R178.1 ; off-sheet LPC_MCU_LINK_RX
LPC_MCU_LINK_SPI1_MISO: R139.1 ; off-sheet LPC_MCU_LINK_SPI1_MISO
LPC_MCU_LINK_SPI1_MOSI: R138.1 ; off-sheet LPC_MCU_LINK_SPI1_MOSI
LPC_MCU_LINK_SPI1_SCLK: R137.1 ; off-sheet LPC_MCU_LINK_SPI1_SCLK
LPC_MCU_LINK_SPI1_SSEL: R136.1 ; off-sheet LPC_MCU_LINK_SPI1_SSEL
LPC_MCU_LINK_TX: R173.1 R179.1 ; off-sheet LPC_MCU_LINK_TX
P0_0/TMS/SWD_DIO: D16.6(K5) J23.2(B1) R129.2 R144.2 ; off-sheet P0_0/TMS/SWD_DIO
P0_1/TCLK/SWD_CLK: D16.5(K4) J22.2 J23.4(B2) R147.1 ; off-sheet P0_1/TCLK/SWD_CLK
P0_2/TDO/SWO: D16.4(K3) J23.6(B3) R130.2 ; off-sheet P0_2/TDO/SWO
P0_3/TDI: D16.3(K2) J23.8(B4) R131.2 R145.2 ; off-sheet P0_3/TDI  [project net P0_3]
P0_6/ISPMODE_N-DEBUG: D15.C J23.7(A4) R133.2 ; off-sheet P0_6/ISPMODE_N-DEBUG
P0_24/FC1_SPI_SDO_MCULINK: R139.2 ; off-sheet P0_24/FC1_SPI_SDO_MCULINK  [project net P0_24]
P0_25/FCI_SPI_SCK_MCULINK: R137.2 ; off-sheet P0_25/FCI_SPI_SCK_MCULINK  [project net P0_25]
P0_26/FC1_SPI_SDI_MCULINK: R138.2 ; off-sheet P0_26/FC1_SPI_SDI_MCULINK  [project net P0_26]
P0_27/FC1_SPI_PCS_MCULINK: R136.2 ; off-sheet P0_27/FC1_SPI_PCS_MCULINK  [project net P0_27]
P1_8/FC4_P0_UART_RXD_MCULINK: R173.2 ; off-sheet P1_8/FC4_P0_UART_RXD_MCULINK
P1_9/FC4_P1_UART_TXD_MCULINK: R172.2 ; off-sheet P1_9/FC4_P1_UART_TXD_MCULINK
P4_0/FC2_I2C_SDA-MCULINK: R141.2 R142.2 ; off-sheet P4_0/FC2_I2C_SDA-MCULINK  [project net P4_0]
P4_1/FC2_I2C_SCL-MCULINK: R140.2 R143.2 ; off-sheet P4_1/FC2_I2C_SCL-MCULINK  [project net P4_1]
P4_2/FC2_P2_UART_TXD_MCULINK: R178.2 ; off-sheet P4_2/FC2_P2_UART_TXD_MCULINK  [project net P4_2]
P4_3/FC2_P3_UART_TXD_MCULINK: R179.2 ; off-sheet P4_3/FC2_P3_UART_TXD_MCULINK  [project net P4_3]
RESET_B: D16.1(K1) J23.10(B5) R132.2 R146.2 ; off-sheet RESET_B
NetD14_C: D14.C J23.9(A5) R134.2 R135.1
NetJ23_1: J23.1(A1) R188.2

### Notes on the sheet
- MCU-Link Debug Interface
- SWDIO/TMS
- SWDCLK/TCK
- SWO/TDO
- TDI
- nRST
- MCU-Link UART
- Debugger Side
  Master
- USB Bridge
- Target Side
  Slave
- (in symbol TitleBlock_FS) Classification:; Drawing Title:; Page Title:; Size; Document Number; Rev; Date:; Sheet; of

### Library data of the parts
*#7 = TitleBlock_FS: as *#6 on sheet 09 MCU_LINK_USB; Page Create Date: March  8, 1995; Page Modify Date: *
D14 D15 = DIODE_TVS: DIODE TVS UNIDIR 3.3VWM 20VC SOD523; CLASS: IC; MFG_PN01: PESD3V3S1UB,115; MFG_NAME01: NEXPERIA; CAD_APPROVED: Yes; AGILE_PN: 480-79814; PCB Footprint: sod523; HEIGHT: 0.65MM
D16 = DIODE_ARRAY_5CH: DIODE TVS UNIDIR 3.3VWM 12VC SOT363; CLASS: IC; MFG_PN01: PESD3V3L5UY,115; MFG_NAME01: NEXPERIA; Temp Range: -65¡ãC ~ 150¡ãC; CAD_APPROVED: Yes; AGILE_PN: 480-79841; HEIGHT: 1.1MM; PCB Footprint: sot-363_0p65_smt
J22 = CONN_HDR_2X1: HDR 1X2 TH 100MIL SP 342H AU 118L; CLASS: IO; JUMPER(DEFAULT): 1-2; AGILE_PN: 210-80468; CAD_APPROVED: Yes; Temp Range: -40¡ãC to 105¡ãC; MFG_NAME01: WURTH ELEKTRONIK EISOS GMBH & CO. KG (ELECTRONIC & ELECTROMEHANICAL COMP); MFG_PN01: 61300211121; HEIGHT: 8.69MM; Package Type: TH; ROHS: Yes; 3D_Mechanical_Footprint_File: http://fcl.am.freescale.net/ALLEGRO/step/hdr1x2_5p48x2p69.STEP; PCB Footprint: hdr1x2_5p48x2p69
J23 = CONN_HDR_5X2: HDR 2X5 TH 50MIL CTR 167H AU 91L; CLASS: IO; MFG_PN01: 0922S0205011N6T-2LF; MFG_NAME01: ANYTRONIC CORPORATION LIMITED; CAD_APPROVED: Yes; FPLIST: hdr_5X2_ftsh_th,hdr_5X2_ftsh_th_nsp,hdr_5X2_ftsh_th_nsp_swd; AGILE_PN: 210-80192; ROHS: Yes; HEIGHT: 4.25MM; PCB Footprint: hdr_5X2_ftsh_th
R129-R131 R136-R139 R142 R143 = RES: RES MF ZERO OHM 1/16W 5% 0402; CLASS: DISCRETE; AGILE_PN: 470-75394; FPLIST: RC0402_25,RC0402_HD,RC0402_X2,0402_CC,rc0402_lamp3; CAD_APPROVED: Yes; MFG_NAME01: BOURNS; MFG_PN01: CR0402-J/-000GLF; PCB Footprint: RC0402_25; HEIGHT: 0.45 MM; Tolerance: 5%; ROHS: Yes
R132 R133 = RES: as R110 on sheet 09 MCU_LINK_USB; PCB Footprint: RC0402_25; ROHS: Yes; Tolerance: 5%; HEIGHT: 0.45 MM
R134 = RES: as R205 on sheet 09 MCU_LINK_USB; PCB Footprint: RC0402_25; HEIGHT: 0.4mm; Tolerance: 1%; ROHS: Yes; 3D_Mechanical_Footprint_File: http://fcl.am.freescale.net/ALLEGRO/step/rc0402_25.STEP
R135 R141 = RES: RES MF 2.2K 1/16W 1% 0402; CLASS: DISCRETE; MFG_PN01: CR0402-FX-2201GLF; MFG_NAME01: Bourns Inc.; Temp Range: -55 ¡ãC to +155 ¡ãC; CAD_APPROVED: yes; FPLIST: RC0402_25,RC0402_HD,0402_CC; AGILE_PN: 470-83213; PCB Footprint: RC0402_25; 3D_Mechanical_Footprint_File: http://fcl.am.freescale.net/ALLEGRO/step/rc0402_25.STEP; ROHS: Yes; HEIGHT: 0.4 MM
R140 = RES: RES MF 2.2K 1/16W 1% 0402; CLASS: DISCRETE; AGILE_PN: 470-83213; FPLIST: RC0402_25,RC0402_HD,0402_CC; CAD_APPROVED: yes; Temp Range: -55 ¡ãC to +155 ¡ãC; MFG_NAME01: Bourns Inc.; MFG_PN01: CR0402-FX-2201GLF; PCB Footprint: RC0402_25; HEIGHT: 0.4 MM; ROHS: Yes; 3D_Mechanical_Footprint_File: http://fcl.am.freescale.net/ALLEGRO/step/rc0402_25.STEP
R144 R146 R147 = RES: as R124 on sheet 09 MCU_LINK_USB; ROHS: Yes; Tolerance: 1%; HEIGHT: 0.4MM; PCB Footprint: RC0402_25
R145 = RES: RES MF 100K 1/16W 1% 0402; CLASS: DISCRETE; AGILE_PN: 470-76240; FPLIST: RC0402_25,RC0402_HD,0402_CC; CAD_APPROVED: Yes; MFG_NAME01: BOURNS; MFG_PN01: CR0402-FX-1003GLF; HEIGHT: 0.4MM; Tolerance: 1%; ROHS: Yes; PCB Footprint: RC0402_25
R172 R173 R179 = RES: RES MF 330 OHM 1/10W 5% 0603; CLASS: DISCRETE; AGILE_PN: 470-75451; FPLIST: RC0603_OV,RC0603,0603_CC; CAD_APPROVED: Yes; MFG_NAME01: BOURNS; MFG_PN01: CR0603-JW-331ELF; HEIGHT: 0.6MM; Tolerance: 5%; ROHS: Yes; PCB Footprint: RC0603_OV
R178 = RES: RES MF 330 OHM 1/10W 5% 0603; CLASS: DISCRETE; MFG_PN01: CR0603-JW-331ELF; MFG_NAME01: BOURNS; CAD_APPROVED: Yes; FPLIST: RC0603_OV,RC0603,0603_CC; AGILE_PN: 470-75451; ROHS: Yes; Tolerance: 5%; HEIGHT: 0.6MM; PCB Footprint: RC0603_OV
R188 = RES: RES MF 100 OHM 1/16W 5% 0402; CLASS: DISCRETE; MFG_PN01: CR0402-JW-101GLF; MFG_NAME01: BOURNS; CAD_APPROVED: Yes; FPLIST: RC0402_25,RC0402_HD,RC0402_X2,0402_CC; AGILE_PN: 470-75591; ROHS: Yes; Tolerance: 5%; HEIGHT: 0.45mm; PCB Footprint: RC0402_25

## Nets that join several sheets
GND: 03 SOC_PORT0~2 (C1.2 C2.2 Y1.2 Y1.4), 04 SOC_PORT3~5 (C100.2 C101.2), 06 USB & PWR (31 pins), 07 SD & QSPI & SENSOR (20 pins), 08 CAN PHY & ETHERNET P (39 pins), 09 MCU_LINK_USB (58 pins), 10 MCU_LINK_DEBUG (7 pins)
P3V3: 04 SOC_PORT3~5 (R148.1 R149.1), 06 USB & PWR (6 pins), 07 SD & QSPI & SENSOR (R200.1 R201.1 R202.1), 08 CAN PHY & ETHERNET P (5 pins), 09 MCU_LINK_USB (9 pins), 10 MCU_LINK_DEBUG (6 pins)
P5V0: 06 USB & PWR (12 pins), 08 CAN PHY & ETHERNET P (J10.3 R199.1)
P5V_MCU_LINK_USB: 06 USB & PWR (D3.A), 09 MCU_LINK_USB (C78.1 L6.2 R106.1)
LPC_DBGIF_DETECT: 09 MCU_LINK_USB (U11.E9), 10 MCU_LINK_DEBUG (R134.1)
LPC_DBGIF_ISP0_CTRL: 09 MCU_LINK_USB (U11.C13), 10 MCU_LINK_DEBUG (R133.1)
LPC_DBGIF_RESET: 09 MCU_LINK_USB (U11.E6), 10 MCU_LINK_DEBUG (R132.1)
LPC_DBGIF_TCK_SWCLK: 09 MCU_LINK_USB (U11.L12), 10 MCU_LINK_DEBUG (J22.1)
LPC_DBGIF_TDI: 09 MCU_LINK_USB (U11.F5), 10 MCU_LINK_DEBUG (R131.1)
LPC_DBGIF_TDO_SWO: 09 MCU_LINK_USB (U11.F8), 10 MCU_LINK_DEBUG (R130.1)
LPC_DBGIF_TMS_SWDIO: 09 MCU_LINK_USB (U11.B11), 10 MCU_LINK_DEBUG (R129.1)
LPC_MCU_LINK_I2C0_SCL: 09 MCU_LINK_USB (U11.A12), 10 MCU_LINK_DEBUG (R143.1)
LPC_MCU_LINK_I2C0_SDA: 09 MCU_LINK_USB (U11.E7), 10 MCU_LINK_DEBUG (R142.1)
LPC_MCU_LINK_RX: 09 MCU_LINK_USB (U11.E12), 10 MCU_LINK_DEBUG (R172.1 R178.1)
LPC_MCU_LINK_SPI1_MISO: 09 MCU_LINK_USB (U11.G13), 10 MCU_LINK_DEBUG (R139.1)
LPC_MCU_LINK_SPI1_MOSI: 09 MCU_LINK_USB (U11.H12), 10 MCU_LINK_DEBUG (R138.1)
LPC_MCU_LINK_SPI1_SCLK: 09 MCU_LINK_USB (U11.G12), 10 MCU_LINK_DEBUG (R137.1)
LPC_MCU_LINK_SPI1_SSEL: 09 MCU_LINK_USB (U11.B12), 10 MCU_LINK_DEBUG (R136.1)
LPC_MCU_LINK_TX: 09 MCU_LINK_USB (U11.A11), 10 MCU_LINK_DEBUG (R173.1 R179.1)
P0_0/TMS/SWD_DIO: 03 SOC_PORT0~2 (U1.A17), 10 MCU_LINK_DEBUG (D16.6 J23.2 R129.2 R144.2)
P0_1/TCLK/SWD_CLK: 03 SOC_PORT0~2 (U1.A16), 10 MCU_LINK_DEBUG (D16.5 J22.2 J23.4 R147.1)
P0_2/TDO/SWO: 03 SOC_PORT0~2 (U1.B16), 10 MCU_LINK_DEBUG (D16.4 J23.6 R130.2)
P0_3: 03 SOC_PORT0~2 (U1.B15), 10 MCU_LINK_DEBUG (D16.3 J23.8 R131.2 R145.2)
P0_6/ISPMODE_N-DEBUG: 03 SOC_PORT0~2 (U1.C14), 10 MCU_LINK_DEBUG (D15.C J23.7 R133.2)
P0_24: 03 SOC_PORT0~2 (U1.B6), 10 MCU_LINK_DEBUG (R139.2)
P0_25: 03 SOC_PORT0~2 (U1.A6), 10 MCU_LINK_DEBUG (R137.2)
P0_26: 03 SOC_PORT0~2 (U1.F10), 10 MCU_LINK_DEBUG (R138.2)
P0_27: 03 SOC_PORT0~2 (U1.E10), 10 MCU_LINK_DEBUG (R136.2)
P1_4/ENET_TXCLK: 03 SOC_PORT0~2 (R159.1), 08 CAN PHY & ETHERNET P (R85.2)
P1_5/ENET_TXEN: 03 SOC_PORT0~2 (R160.1), 08 CAN PHY & ETHERNET P (R71.1)
P1_6/ENET_TXD0: 03 SOC_PORT0~2 (R161.1), 08 CAN PHY & ETHERNET P (U9.22)
P1_7/ENET_TXD1: 03 SOC_PORT0~2 (R162.1), 08 CAN PHY & ETHERNET P (U9.23)
P1_8/FC4_P0_UART_RXD_MCULINK: 03 SOC_PORT0~2 (U1.A1), 10 MCU_LINK_DEBUG (R173.2)
P1_9/FC4_P1_UART_TXD_MCULINK: 03 SOC_PORT0~2 (U1.B1), 10 MCU_LINK_DEBUG (R172.2)
P1_10/CAN0_TXD: 03 SOC_PORT0~2 (R157.1), 08 CAN PHY & ETHERNET P (U10.1)
P1_11/CAN0_RXD: 03 SOC_PORT0~2 (R158.1), 08 CAN PHY & ETHERNET P (U10.4)
P1_11/I3C1_PUR: 03 SOC_PORT0~2 (R169.1), 07 SD & QSPI & SENSOR (R53.1)
P1_13/ENET_RXDV/MODE2: 03 SOC_PORT0~2 (R163.1), 08 CAN PHY & ETHERNET P (R75.1 R89.1)
P1_14/ENET_RXD0/MODE0: 03 SOC_PORT0~2 (R164.1), 08 CAN PHY & ETHERNET P (R79.1 R88.1)
P1_15/ENET_RXD1/MODE1: 03 SOC_PORT0~2 (R165.1), 08 CAN PHY & ETHERNET P (R80.1 R90.1)
P1_16: 03 SOC_PORT0~2 (U1.F6), 07 SD & QSPI & SENSOR (R52.1 R53.2 R55.1)
P1_17: 03 SOC_PORT0~2 (U1.F4), 07 SD & QSPI & SENSOR (R51.1 R56.1)
P1_20/ENET_MDC: 03 SOC_PORT0~2 (U1.K5), 08 CAN PHY & ETHERNET P (R191.1)
P1_21/ENET_MDIO: 03 SOC_PORT0~2 (R166.1), 08 CAN PHY & ETHERNET P (R155.2 U9.16)
P2_1/SDHC0_CD_B: 03 SOC_PORT0~2 (U1.H1), 07 SD & QSPI & SENSOR (J7.9 R57.2 TP27.1)
P2_2: 03 SOC_PORT0~2 (R168.2 U1.H3), 07 SD & QSPI & SENSOR (J7.8 TP5.1)
P2_3: 03 SOC_PORT0~2 (U1.J3), 07 SD & QSPI & SENSOR (J7.7 TP4.1)
P2_4: 03 SOC_PORT0~2 (U1.K3), 07 SD & QSPI & SENSOR (J7.5 TP26.1)
P2_5: 03 SOC_PORT0~2 (U1.K1), 07 SD & QSPI & SENSOR (J7.3 TP25.1)
P2_6: 03 SOC_PORT0~2 (U1.K2), 07 SD & QSPI & SENSOR (J7.2 R54.1 TP24.1)
P2_7: 03 SOC_PORT0~2 (U1.L2), 07 SD & QSPI & SENSOR (J7.1 TP23.1)
P3_0/FLEXSPI0_A_SS0_b: 04 SOC_PORT3~5 (U1.B17), 07 SD & QSPI & SENSOR (5 pins)
P3_1/FLEXSPI0_A_SS1_b: 04 SOC_PORT3~5 (U1.C15), 07 SD & QSPI & SENSOR (TP31.1)
P3_6/FLEXSPI0_A_DQS: 04 SOC_PORT3~5 (U1.D17), 07 SD & QSPI & SENSOR (TP8.1 U7.C3)
P3_7/FLEXSPI0_A_SCLK: 04 SOC_PORT3~5 (U1.D14), 07 SD & QSPI & SENSOR (TP18.1 U7.B2 U8.6)
P3_8/FLEXSPI0_A_DATA0: 04 SOC_PORT3~5 (U1.E14), 07 SD & QSPI & SENSOR (TP16.1 U7.D3 U8.5)
P3_9/FLEXSPI0_A_DATA1: 04 SOC_PORT3~5 (U1.F15), 07 SD & QSPI & SENSOR (TP15.1 U7.D2 U8.2)
P3_10/FLEXSPI0_A_DATA2: 04 SOC_PORT3~5 (U1.F17), 07 SD & QSPI & SENSOR (R59.2 TP13.1 U7.C4 U8.3)
P3_11/FLEXSPI0_A_DATA3: 04 SOC_PORT3~5 (U1.F16), 07 SD & QSPI & SENSOR (R60.2 TP14.1 U7.D4 U8.7)
P3_12/FLEXSPI0_A_DATA4: 04 SOC_PORT3~5 (U1.G16), 07 SD & QSPI & SENSOR (TP17.1 U7.D5)
P3_13/FLEXSPI0_A_DATA5: 04 SOC_PORT3~5 (U1.H16), 07 SD & QSPI & SENSOR (TP11.1 U7.E3)
P3_14/FLEXSPI0_A_DATA6: 04 SOC_PORT3~5 (U1.H17), 07 SD & QSPI & SENSOR (TP10.1 U7.E2)
P3_15/FLEXSPI0_A_DATA7: 04 SOC_PORT3~5 (U1.H15), 07 SD & QSPI & SENSOR (TP9.1 U7.E1)
P4_0: 04 SOC_PORT3~5 (R148.2 U1.P1), 06 USB & PWR (R45.1), 10 MCU_LINK_DEBUG (R141.2 R142.2)
P4_1: 04 SOC_PORT3~5 (R149.2 U1.P2), 06 USB & PWR (R43.1), 10 MCU_LINK_DEBUG (R140.2 R143.2)
P4_2: 04 SOC_PORT3~5 (U1.T1), 10 MCU_LINK_DEBUG (R178.2)
P4_3: 04 SOC_PORT3~5 (U1.U1), 10 MCU_LINK_DEBUG (R179.2)
P4_16: 04 SOC_PORT3~5 (U1.R8), 06 USB & PWR (R34.1)
P4_17: 04 SOC_PORT3~5 (U1.R9), 06 USB & PWR (R28.1)
P5_7/ME_INT: 04 SOC_PORT3~5 (U1.L13), 06 USB & PWR (R46.1)
RESET_B: 07 SD & QSPI & SENSOR (R61.1), 10 MCU_LINK_DEBUG (D16.1 J23.10 R132.2 R146.2)